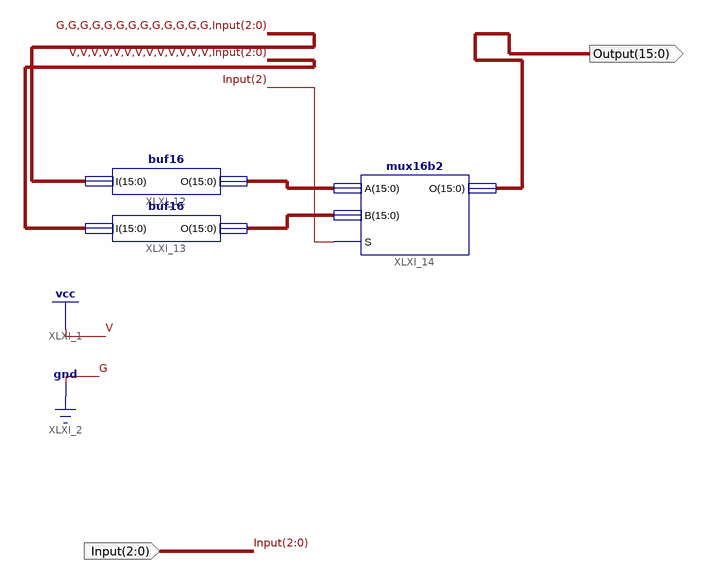
[diagram p0: schematic sheet 1]
// Xilinx ISE schematic Sign_Extended_3bits.sch (spartan3e) as structural Verilog: 3 symbols, 2 ports
module Sign_Extended_3bits (
  input  [2:0] Input,
  output [15:0] Output
);

  wire [15:0] XLXN_14, XLXN_15;

  buf16 XLXI_12 (.I({{13{1'b0}}, Input}), .O(XLXN_14));
  buf16 XLXI_13 (.I({{13{1'b1}}, Input}), .O(XLXN_15));
  mux16b2 XLXI_14 (.A(XLXN_14), .B(XLXN_15), .S(Input[2]), .O(Output));
endmodule
